# EAGLE design ESP_CAM_VVN (EAGLE 9.6.2)
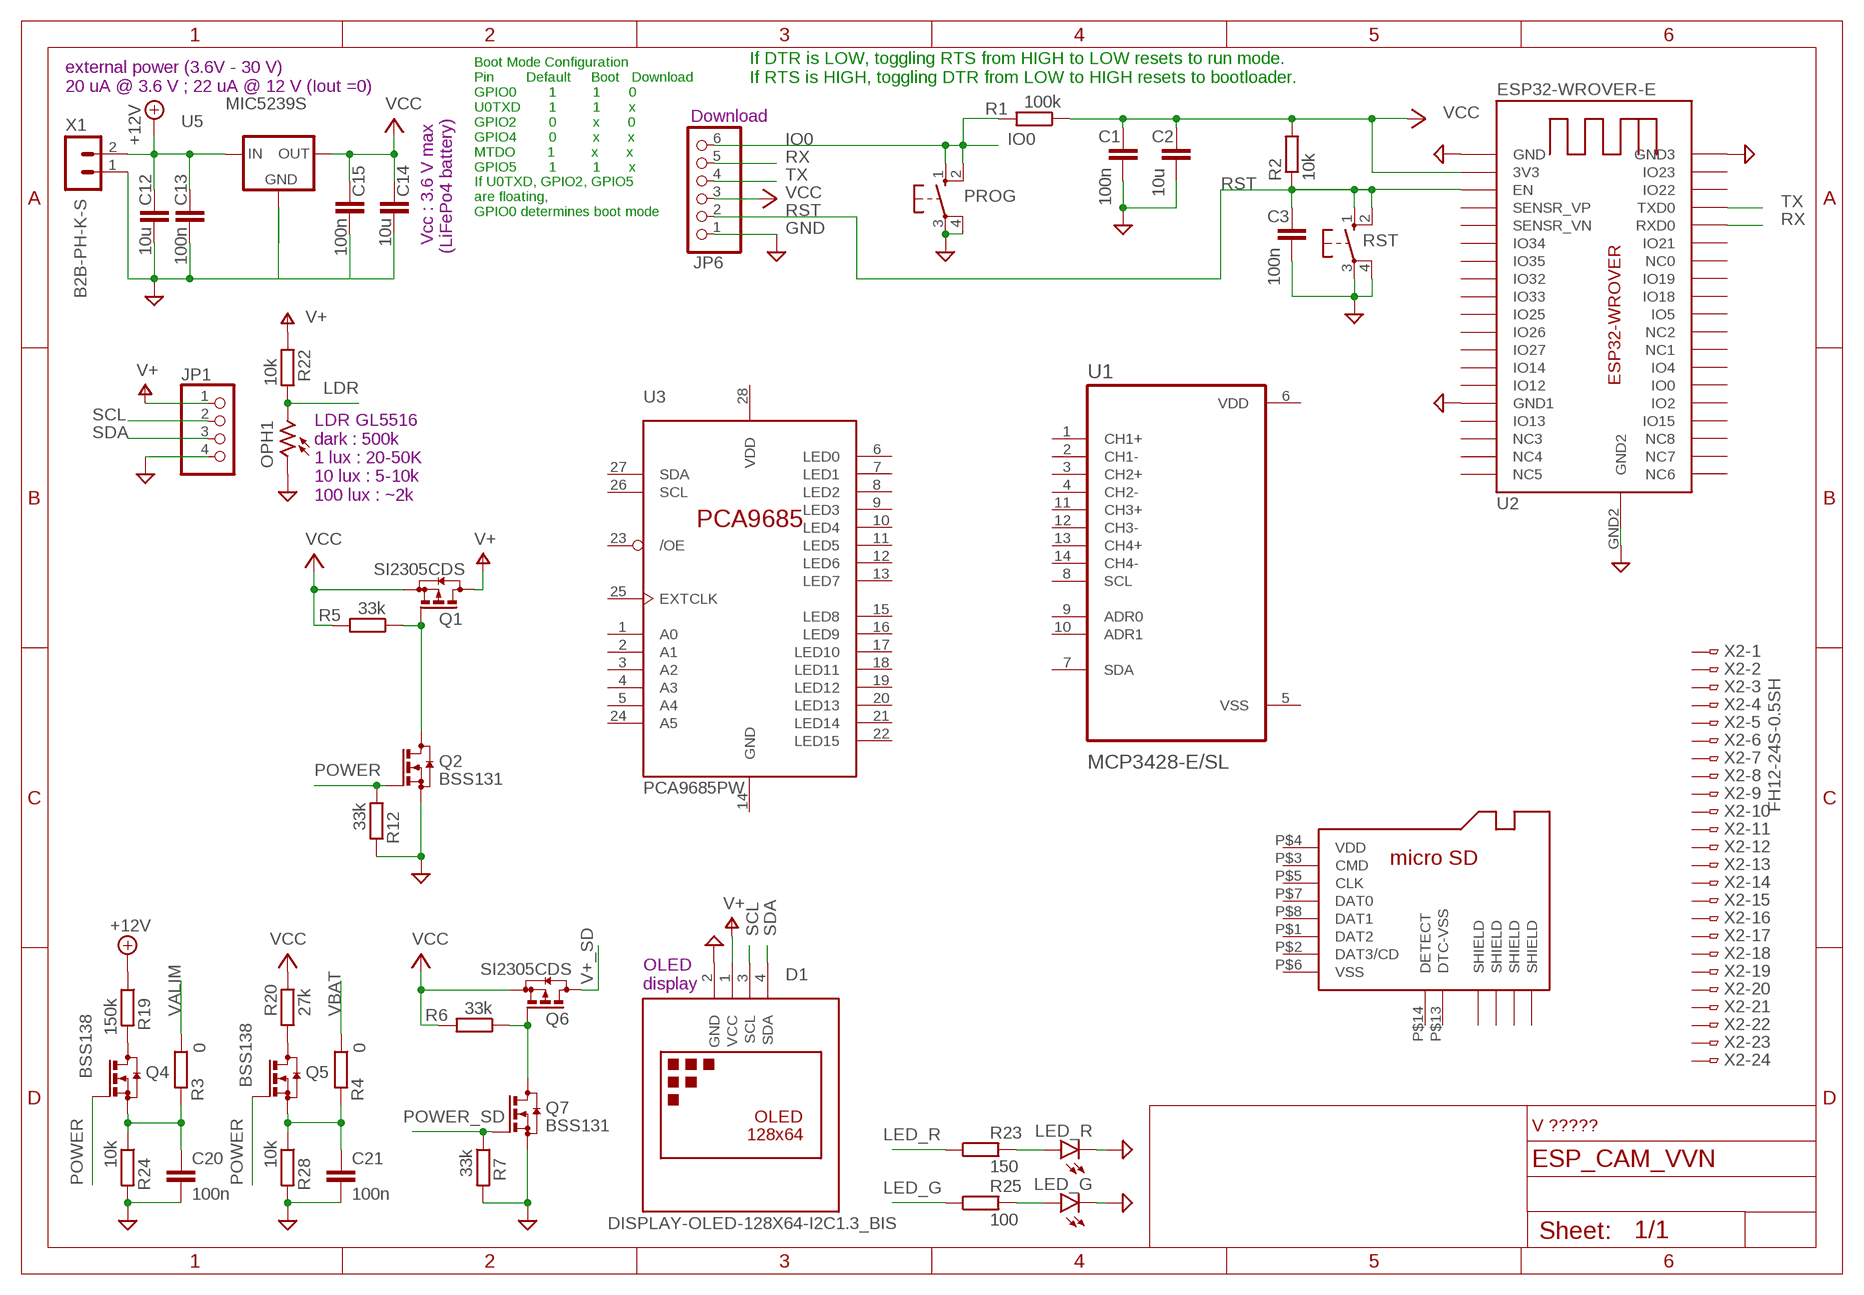
[diagram p0: schematic, sheet 1]

## Parts
C1  100n  CC1206  [C1206]
C2  10u  CC1210  [C1210]
C3  100n  CC1206  [C1206]
C12  10u  CC1210  [C1210]
C13  100n  CC1206  [C1206]
C14  10u  CC1210  [C1210]
C15  100n  CC1206  [C1206]
C20  100n  CC1206  [C1206]
C21  100n  CC1206  [C1206]
D1  DISPLAY-OLED-128X64-I2C1.3_BIS  [DISPLAY-OLED-128X64-1.3-I2C_BIS]
JP1  PINHD-1X4  [1X04]
JP6  PINHD-1X6  [1X06]
LED_G  LEDSMT1206  [1206]
LED_R  LEDSMT1206  [1206]
OPH1  VT93N2  [VT900]
PROG  10-XX  [B3F-10XX]
Q1  SI2305CDS  [SOT23]
Q2  BSS131  [SOT23]
Q4  BSS138  [SOT23]
Q5  BSS138  [SOT23]
Q6  SI2305CDS  [SOT23]
Q7  BSS131  [SOT23]
R1  100k  RR1206  [R1206]
R2  10k  RR1206  [R1206]
R3  0  RR1206  [R1206]
R4  0  RR1206  [R1206]
R5  33k  RR1206  [R1206]
R6  33k  RR1206  [R1206]
R7  33k  RR1206  [R1206]
R12  33k  RR1206  [R1206]
R19  150k  RR1206  [R1206]
R20  27k  RR1206  [R1206]
R22  10k  RR1206  [R1206]
R23  150  RR1206  [R1206]
R24  10k  RR1206  [R1206]
R25  100  RR1206  [R1206]
R28  10k  RR1206  [R1206]
RST  10-XX  [B3F-10XX]
SD1  MICRO-SD-8  [MICROSDMOLEX]
U1  MCP3428-E/SL  [SOIC127P600X175-14N]
U2  ESP32-WROVER-E  [ESP32-WROVER]
U3  PCA9685PW  [TSSOP28]
U5  MIC5239S  [SOT223]
X1  B2B-PH-K-S  [B2B-PH-K-S]
X2  FH12-24S-0.5SH  [FH12-24S-0.5SH]

## Nets
+12V: C12.1 C13.1 R19.1 U5.1(IN) X1.2
GND: C1.2 C2.2 C3.2 C12.2 C13.2 C14.2 C15.2 C20.2 C21.2 D1.2(GND) JP1.4 JP6.1 LED_G.C LED_R.C OPH1.1 PROG.3(P) PROG.4(P1) Q2.2(S) Q7.2(S) R7.2 R12.2 R24.2 R28.2 RST.3(P) RST.4(P1) U2.GND U2.GND1 U2.GND2 U2.GND3 U5.2(GND) U5.4(GND) X1.1
IO0: JP6.6 PROG.1(S) PROG.2(S1) R1.2
LDR: OPH1.2 R22.2
LED_G: R25.1
LED_R: R23.1
N$1: Q1.1(G) Q2.3(D) R5.1
N$2: Q4.3(D) R19.2
N$3: C20.1 Q4.2(S) R3.2 R24.1
N$4: C21.1 Q5.2(S) R4.2 R28.1
N$5: Q5.3(D) R20.1
N$6: Q6.1(G) Q7.3(D) R6.1
N$7: LED_R.A R23.2
N$8: LED_G.A R25.2
POWER: Q2.1(G) Q4.1(G) Q5.1(G) R12.1
POWER_SD: Q7.1(G) R7.1
RST: C3.1 JP6.2 R2.1 RST.1(S) RST.2(S1) U2.EN
RX: JP6.5 U2.RXD0
SCL: D1.3(SCL) JP1.2
SDA: D1.4(SDA) JP1.3
TX: JP6.4 U2.TXD0
V+: D1.1(VCC) JP1.1 Q1.3(D) R22.1
V+_SD: Q6.3(D)
VALIM: R3.1
VBAT: R4.1
VCC: C1.1 C2.1 C14.1 C15.1 JP6.3 Q1.2(S) Q6.2(S) R1.1 R2.2 R5.2 R6.2 R20.2 U2.VDD33(3V3) U5.3(OUT)
Unconnected: SD1.P$1(DAT2) SD1.P$2(DAT3/CD) SD1.P$3(CMD) SD1.P$5(CLK) SD1.P$7(DAT0) SD1.P$8(DAT1) U1.1(CH1+) U1.2(CH1-) U1.3(CH2+) U1.4(CH2-) U1.7(SDA) U1.8(SCL) U1.9(ADR0) U1.10(ADR1) U1.11(CH3+) U1.12(CH3-) U1.13(CH4+) U1.14(CH4-) U2.CLK(NC3) U2.CMD(NC4) U2.IO0 U2.IO2 U2.IO4 U2.IO5 U2.IO12 U2.IO13 U2.IO14 U2.IO15 U2.IO18 U2.IO19 U2.IO21 U2.IO22 U2.IO23 U2.IO25 U2.IO26 U2.IO27 U2.IO32 U2.IO33 U2.IO34 U2.IO35 U2.NC0 U2.NC1 U2.NC2 U2.SD0(NC5) U2.SD1(NC6) U2.SD2(NC7) U2.SD3(NC8) U2.SENSOR_VN(SENSR_VN) U2.SENSOR_VP(SENSR_VP) U3.1(A0) U3.2(A1) U3.3(A2) U3.4(A3) U3.5(A4) U3.6(LED0) U3.7(LED1) U3.8(LED2) U3.9(LED3) U3.10(LED4) U3.11(LED5) U3.12(LED6) U3.13(LED7) U3.15(LED8) U3.16(LED9) U3.17(LED10) U3.18(LED11) U3.19(LED12) U3.20(LED13) U3.21(LED14) U3.22(LED15) U3.23(/OE) U3.24(A5) U3.25(EXTCLK) U3.26(SCL) U3.27(SDA) X2.1 X2.2 X2.3 X2.4 X2.5 X2.6 X2.7 X2.8 X2.9 X2.10 X2.11 X2.12 X2.13 X2.14 X2.15 X2.16 X2.17 X2.18 X2.19 X2.20 X2.21 X2.22 X2.23 X2.24

## Notes on the sheet
- If DTR is LOW, toggling RTS from HIGH to LOW resets to run mode.
  If RTS is HIGH, toggling DTR from LOW to HIGH resets to bootloader.
- external power (3.6V - 30 V)
  20 uA @ 3.6 V ; 22 uA @ 12 V (Iout =0)
- Download
- Vcc : 3.6 V max 
  (LiFePo4 battery)
- Boot Mode Configuration
  Pin        Default     Boot   Download
  GPIO0        1         1       0
  U0TXD       1         1       x
  GPIO2        0         x       0
  GPIO4        0         x       x
  MTDO        1         x       x
  GPIO5        1         1       x
  If U0TXD, GPIO2, GPIO5 
  are floating, 
  GPIO0 determines boot mode
- LDR GL5516
  dark : 500k
  1 lux : 20-50K
  10 lux : 5-10k
  100 lux : ~2k
- OLED 
  display
- V ?????

## Power pins joined to a net without a drawn wire
DETECT: SD1.P$14(DETECT)
DTC-VSS: SD1.P$13(DTC-VSS)
GND: U3.14(GND)
SHIELD: SD1.P$9(SHIELD) SD1.P$10(SHIELD) SD1.P$11(SHIELD) SD1.P$12(SHIELD)
VDD: SD1.P$4(VDD) U1.6(VDD) U3.28(VDD)
VSS: SD1.P$6(VSS) U1.5(VSS)

## Library data of the parts
C1-C3 C12-C15 C20 C21 = eagle-ltspice:C: CAPACITOR, European symbol; SPICEMODEL: NONE; SPICEPREFIX: C
D1 = diy-modules1.8-perso:DISPLAY-OLED-128X64-I2C: 128x64 Dot Matrix OLED Module based on SSD1306 chip Variant with I2C interface More details available here: http://www.instructables.com/id/Monochrome-096-i2c-OLED-display-with-arduino-SSD13/ SSD1306 datasheet: https://cdn-shop.adafruit.com/datasheets/SSD1306.pdf Click here to find device on ebay.com <http://www.ebay.com/sch/oled+display+128x64+iic> Note: There are two variants: I2C and SPI. Search for the proper version.
JP1 = pinhead:PINHD-1X4: PIN HEADER
JP6 = pinhead:PINHD-1X6: PIN HEADER
LED_G LED_R = led:LED: LED OSRAM: - CHIPLED LG R971, LG N971, LY N971, LG Q971, LY Q971, LO R971, LY R971 LH N974, LH R974 LS Q976, LO Q976, LY Q976 LO Q996 - Hyper CHIPLED LW Q18S LB Q993, LB Q99A, LB R99A - SideLED LS A670, LO A670, LY A670, LG A670, LP A670 LB A673, LV A673, LT A673, LW A673 LH A674 LY A675 LS A676, LA A676, LO A676, LY A676, LW A676 LS A679, LY A679, LG A679 - Hyper Micro SIDELED® LS Y876, LA Y876, LO Y876, LY Y876 LT Y87S - SmartLED LW L88C, LW L88S LB L89C, LB L89S, LG L890 LS L89K, LO L89K, LY L89K LS L896, LA L896, LO L896, LY L896 - TOPLED LS T670, LO T670, LY T670, LG T670, LP T670 LSG T670, LSP T670, LSY T670, LOP T670, LYG T670 LG T671, LOG T671, LSG T671 LB T673, LV T673, LT T673, LW T673 LH T674 LS T676, LA T676, LO T676, LY T676, LB T676, LH T676, LSB T676, LW T676 LB T67C, LV T67C, LT T67C, LS T67K, LO T67K, LY T67K, LW E67C LS E67B, LA E67B, LO E67B, LY E67B, LB E67C, LV E67C, LT E67C LW T67C LS T679, LY T679, LG T679 LS T770, LO T770, LY T770, LG T770, LP T770 LB T773, LV T773, LT T773, LW T773 LH T774 LS E675, LA E675, LY E675, LS T675 LS T776, LA T776, LO T776, LY T776, LB T776 LHGB T686 LT T68C, LB T68C - Hyper Mini TOPLED® LB M676 - Mini TOPLED Santana® LG M470 LS M47K, LO M47K, LY M47K Source: http://www.osram.convergy.de LUXEON: - LUMILED® LXK2-PW12-R00, LXK2-PW12-S00, LXK2-PW14-U00, LXK2-PW14-V00 LXK2-PM12-R00, LXK2-PM12-S00, LXK2-PM14-U00 LXK2-PE12-Q00, LXK2-PE12-R00, LXK2-PE12-S00, LXK2-PE14-T00, LXK2-PE14-U00 LXK2-PB12-K00, LXK2-PB12-L00, LXK2-PB12-M00, LXK2-PB14-N00, LXK2-PB14-P00, LXK2-PB14-Q00 LXK2-PR12-L00, LXK2-PR12-M00, LXK2-PR14-Q00, LXK2-PR14-R00 LXK2-PD12-Q00, LXK2-PD12-R00, LXK2-PD12-S00 LXK2-PH12-R00, LXK2-PH12-S00 LXK2-PL12-P00, LXK2-PL12-Q00, LXK2-PL12-R00 Source: www.luxeon.com KINGBRIGHT: KA-3528ASYC Source: www.kingbright.com
OPH1 = photo-elements:VT9: Photoconductive Cell VT900 Series Source: http://optoelectronics.perkinelmer.com/content/Datasheets/DTS_vt900seriesdatasheet.pdf
PROG RST = switch-omron:10-XX: OMRON SWITCH; MPN: B3F-1000; OC_FARNELL: 176432; OC_NEWARK: 36M3542
Q1 Q6 = transistor-small-signal-perso:SI2305CDS: P-CHANNEL MOS FET
Q2 Q7 = transistor-small-signal-perso:BSS131: N-CHANNEL MOS FET
Q4 Q5 = detect:BSS138: N-CHANNEL MOS FET
R1-R7 R12 R19 R20 R22-R25 R28 = eagle-ltspice:R: RESISTOR, European symbol; SPICEMODEL: NONE; SPICEPREFIX: R
SD1 = micro-sd_cp:MICRO-SD-8: Connecteur de carte mémoire microSD de Molex - Séries 503398 et 504077
U1 = MCP3428-E_SL:MCP3428-E/SL: Check prices <https://pricing.snapeda.com/parts/MCP3428-E/SL/Microchip/view-part?ref=eda>; AVAILABILITY: In Stock; DESCRIPTION: 16 Bit Analog to Digital Converter 4 Input 1 Sigma-Delta 14-SOIC; MF: Microchip; MP: MCP3428-E/SL; PACKAGE: SOIC-14 Microchip; PRICE: None; PURCHASE-URL: https://pricing.snapeda.com/search/part/MCP3428-E/SL/?ref=eda
U2 = 32teeth - ESP32-WROVER:ESP32-WROVER-E: ESP32-WROVER-E
U3 = i2c-led-controller:PCA9685
U5 = micrel:MIC5239S: LDO REGULATOR
X1 = con-JST PH:B2B-PH: JST PH series header 2.00mm pitch disconnectable crimp style connectors, vertical (side entry type), 2 pins
X2 = con-hirose:FH12-24S-0.5S: 0.5mm Pitch Connectors For FPC/FFC Source: Data sheet <http://www.hirose.co.jp/cataloge_hp/e58605370.pdf>; MPN: FH12-24S-0.5SH(55); OC_FARNELL: 1324552; OC_NEWARK: 34M6170

## Board
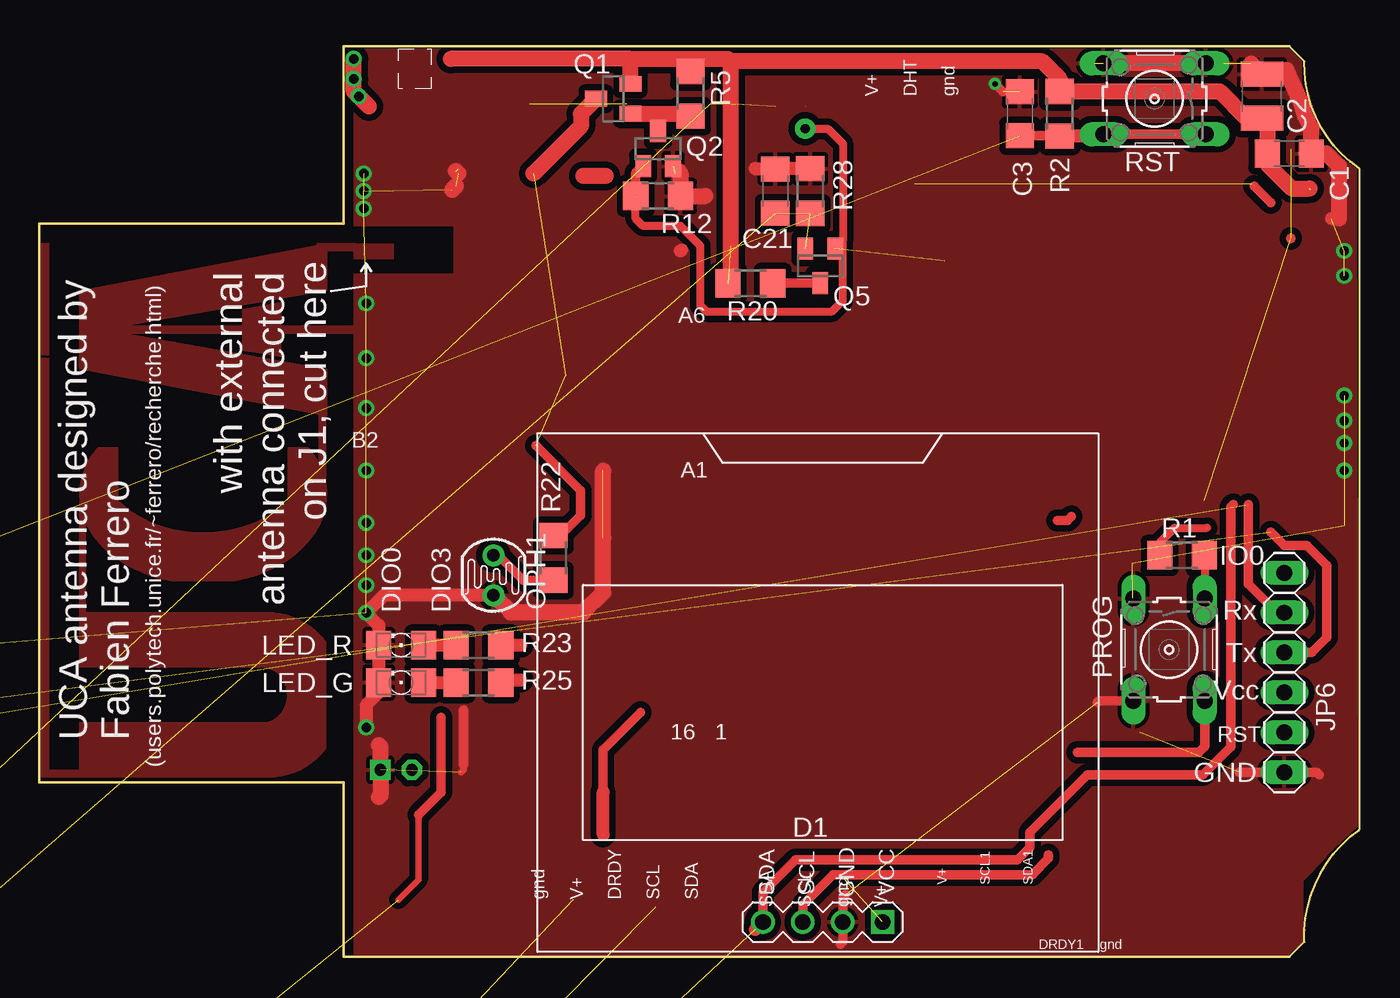
[diagram p1: board, top side]
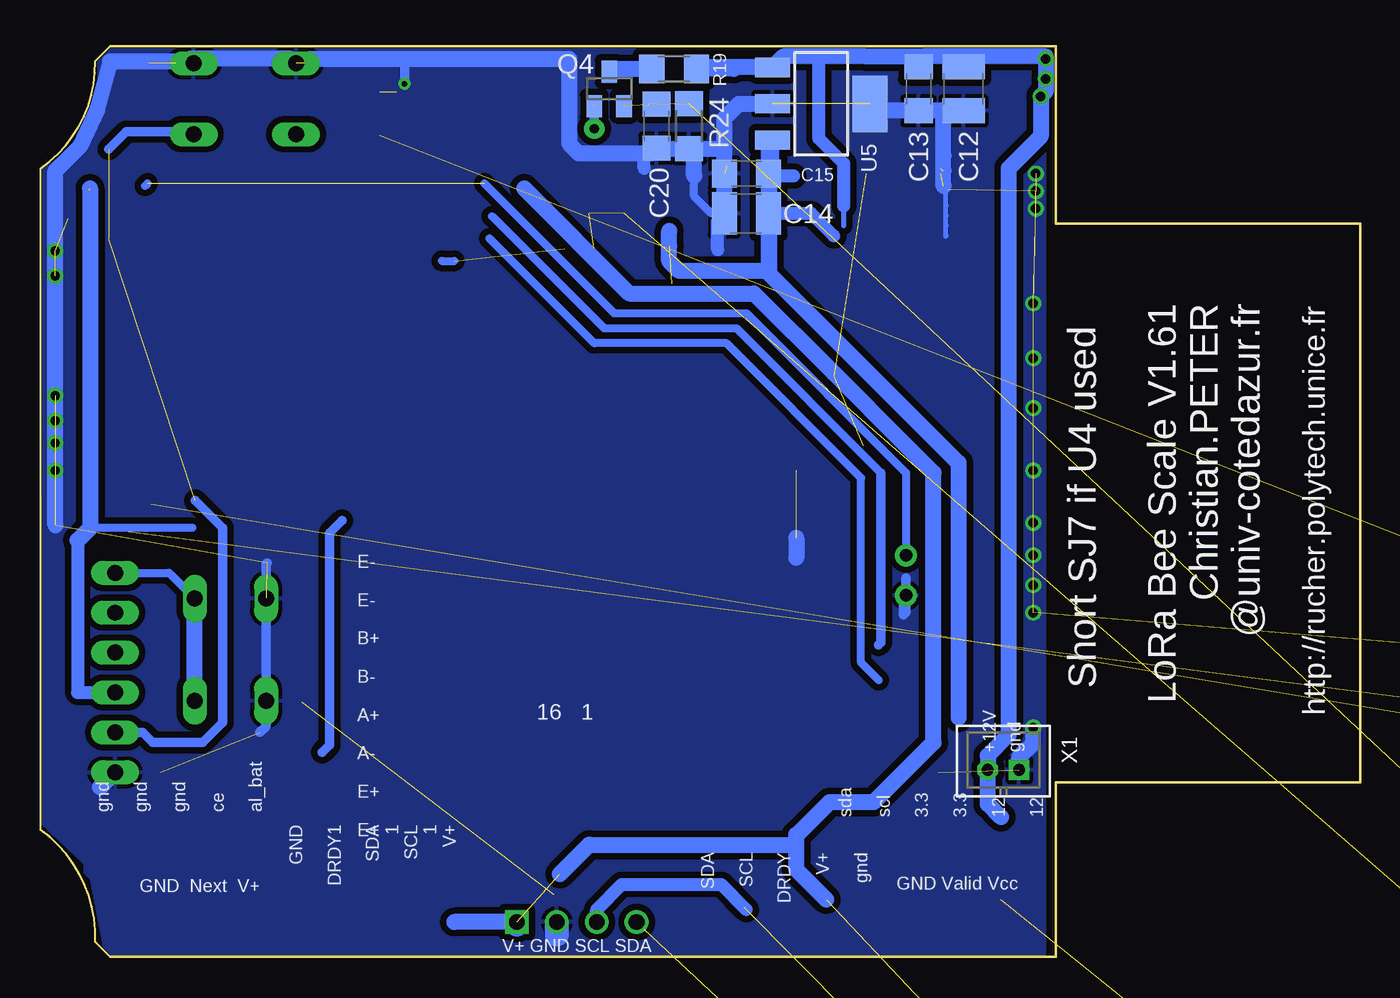
[diagram p2: board, bottom side, seen from below]

Size 83.98 x 57.94 mm. Coordinates in mm from the lower left corner, seen from the top.
Outline: 19.37,0 19.37,11.11 0,11.11 0,46.67 19.37,46.67 19.37,57.94 79.53,57.94 80.49,56.99 arc56 83.98,50.16 83.98,8.1 arc56 80.49,0.95 79.53,0 19.37,0
Copper layers (1*16): Top 0.035mm / dielectric 1.5mm / Bottom 0.035mm
Design rules "default *": minimum track width 6mil, minimum drill 0.35mm, track to track 6mil, track to pad 6mil, pad to pad 6mil, via to via 6mil, smd to smd 6mil, copper to edge 0mil, drill to drill 6mil, minimum pad ring 10mil, minimum via ring 8mil, stop-mask expansion 4mil, vias tented up to drill 0mil, thermal gap 10mil

### Footprints (pad centres in the part's own frame; a part is rotated, then mirrored left to right if it is on the bottom)
C1206 = smd 1.6 x 1.8: 1 -1.4,0; 2 1.4,0
C1210 = smd 1.6 x 2.7: 1 -1.4,0; 2 1.4,0
DISPLAY-OLED-128X64-1.3-I2C_BIS = drill 1 square: 1 -3.81,14.605 | drill 1: 2 -1.27,14.605; 3 1.27,14.605; 4 3.81,14.605
1X04 = drill 1.016 long: 1 -3.81,0; 2 -1.27,0; 3 1.27,0; 4 3.81,0
1X06 = drill 1.016 long: 1 -6.35,0; 2 -3.81,0; 3 -1.27,0; 4 1.27,0; 5 3.81,0; 6 6.35,0
1206 = smd 1.6 x 1.803: A -1.422,0; C 1.422,0
VT900 = drill 0.8 pad 1.4: 1 -1.27,0; 2 1.27,0
B3F-10XX = drill 1.016 long: 1 -3.251,2.261; 2 3.251,2.261; 3 -3.251,-2.261; 4 3.251,-2.261
SOT23 = smd 1 x 1.4: 1 -0.95,-1.1; 2 0.95,-1.1; 3 0,1.1
R1206 = smd 1.6 x 1.803: 1 -1.422,0; 2 1.422,0
MICROSDMOLEX = smd 0.7 x 1.1: P$1 12.15,-0.9; P$2 11.05,-0.9; P$3 9.95,-0.9; P$4 8.85,-0.9; P$5 7.75,-0.9; P$6 6.65,-0.9; P$7 5.55,-0.9; P$8 4.45,-0.9 | smd 1.14 x 1.83: P$9 0.57,-0.915 | smd 0.7 x 3.33: P$10 0.35,-12.165; P$11 13.31,-12.165 | smd 0.86 x 2.8: P$12 13.23,-1.4 | smd 0.9 x 0.93: P$13 2.66,-13.365 | smd 1.05 x 0.78: P$14 6.925,-13.44
SOIC127P600X175-14N = smd 1.9 x 0.6: 1 -2.455,3.81; 2 -2.455,2.54; 3 -2.455,1.27; 4 -2.455,0; 5 -2.455,-1.27; 6 -2.455,-2.54; 7 -2.455,-3.81; 8 2.455,-3.81; 9 2.455,-2.54; 10 2.455,-1.27; 11 2.455,0; 12 2.455,1.27; 13 2.455,2.54; 14 2.455,3.81
ESP32-WROVER = smd 1.7 x 0.9: CLK 18,1.27; CMD 0,1.27; EN 0,21.59; GND 0,24.13; GND1 0,6.35; GND3 18,24.13; IO0 18,7.62; IO2 18,6.35; IO4 18,8.89; IO5 18,12.7; IO12 0,7.62; IO13 0,5.08; IO14 0,8.89; IO15 18,5.08; IO18 18,13.97; IO19 18,15.24; IO21 18,17.78; IO22 18,21.59; IO23 18,22.86; IO25 0,12.7; IO26 0,11.43; IO27 0,10.16; IO32 0,15.24; IO33 0,13.97; IO34 0,17.78; IO35 0,16.51; NC0 18,16.51; NC1 18,10.16; NC2 18,11.43; RXD0 18,19.05; SD0 18,2.54; SD1 18,3.81; SD2 0,3.81; SD3 0,2.54; SENSOR_VN 0,19.05; SENSOR_VP 0,20.32; TXD0 18,20.32; VDD33 0,22.86 | smd 4.5 x 4.5: GND2 7.62,16.34
TSSOP28 = smd 0.305 x 0.991: 1 -4.225,-2.918; 2 -3.575,-2.918; 3 -2.925,-2.918; 4 -2.275,-2.918; 5 -1.625,-2.918; 6 -0.975,-2.918; 7 -0.325,-2.918; 8 0.325,-2.918; 9 0.975,-2.918; 10 1.625,-2.918; 11 2.275,-2.918; 12 2.925,-2.918; 13 3.575,-2.918; 14 4.225,-2.918; 15 4.225,2.918; 16 3.575,2.918; 17 2.925,2.918; 18 2.275,2.918; 19 1.625,2.918; 20 0.975,2.918; 21 0.325,2.918; 22 -0.325,2.918; 23 -0.975,2.918; 24 -1.625,2.918; 25 -2.275,2.918; 26 -2.925,2.918; 27 -3.575,2.918; 28 -4.225,2.918
SOT223 = smd 1.219 x 2.235: 1 -2.311,-3.099; 2 0,-3.099; 3 2.311,-3.099 | smd 3.6 x 2.2: 4 0,3.099
B2B-PH-K-S = drill 0.75 pad 1.3 square: 1 1,0 | drill 0.75 pad 1.3 octagon: 2 -1,0
FH12-24S-0.5SH = smd 0.3 x 1.3: 1 -5.75,3.25; 2 -5.25,3.25; 3 -4.75,3.25; 4 -4.25,3.25; 5 -3.75,3.25; 6 -3.25,3.25; 7 -2.75,3.25; 8 -2.25,3.25; 9 -1.75,3.25; 10 -1.25,3.25; 11 -0.75,3.25; 12 -0.25,3.25; 13 0.25,3.25; 14 0.75,3.25; 15 1.25,3.25; 16 1.75,3.25; 17 2.25,3.25; 18 2.75,3.25; 19 3.25,3.25; 20 3.75,3.25; 21 4.25,3.25; 22 4.75,3.25; 23 5.25,3.25; 24 5.75,3.25

### Placement (x,y rotation side)
C1  79.53,51.12 0 top
C2  77.79,54.77 90 top
C3  62.39,53.66 90 top
C12  25.24,55.24 270 bottom
C13  28.1,55.24 270 bottom
C14  39.05,47.31 180 bottom
C15  39.05,49.85 180 bottom
C20  44.77,52.86 270 bottom
C21  46.83,48.74 90 top
D1  49.85,16.83 180 top
JP1  -23.18,-61.12 0 top  (outside the outline)
JP6  79.22,18.1 90 top
LED_G  23.02,17.46 180 top
LED_R  23.02,19.84 180 top
OPH1  28.89,24.29 90 top
PROG  71.88,19.56 270 top
Q1  36.51,54.61 90 top
Q2  39.37,51.44 0 top
Q4  47.78,55.24 0 bottom
Q5  49.69,43.97 180 top
Q6  -26.51,-21.91 0 top  (outside the outline)
Q7  -26.51,-29.37 0 top  (outside the outline)
R1  72.71,25.56 0 top
R2  64.93,53.66 90 top
R3  -26.35,-8.89 0 top  (outside the outline)
R4  -26.35,-15.08 0 top  (outside the outline)
R5  41.43,54.93 90 top
R6  -18.73,-28.73 0 top  (outside the outline)
R7  -26.35,-36.2 0 top  (outside the outline)
R12  39.37,48.42 0 top
R19  43.66,56.52 180 bottom
R20  45.24,42.86 180 top
R22  32.7,25.4 270 top
R23  27.94,19.84 180 top
R24  42.7,52.86 270 bottom
R25  27.94,17.46 180 top
R28  49.05,48.74 90 top
RST  70.96,54.61 180 top
SD1  3.33,-9.84 0 top  (outside the outline)
U1  -32.7,-65.56 0 top  (outside the outline)
U2  -27.94,-4.76 0 top  (outside the outline)
U3  -30.48,-75.72 0 top  (outside the outline)
U5  34.29,54.29 270 bottom
X1  22.7,11.91 0 bottom
X2  -20.32,-68.9 0 top  (outside the outline)

### Tracks (layer width: path | path; a pad name or v marks a point on that pad's centre or on a via)
+12V  (via drill 0.6)
  Top 1.016: 20.96,54.13 v20.32,54.77 20,55.09 v20,55.88 v20,57.15
  Bottom 0.305: 27.79,57.3 27.78,57.31 | 31.43,57.31 31.44,57.3 | 30.14,57.29 30.16,57.31 | 32.85,46.51 32.86,46.51 32.86,47.78 32.84,47.81
  Bottom 0.813: 32.86,47.78 32.86,50.48 34.45,52.07 34.45,57.3
  Bottom 1.016: 25.24,57.31 20,57.31 20,55.09 v20.32,54.77 20.32,52.23 22.38,50.16 22.38,14.13 23.7,12.81 X1.2 23.7,9.73 22.86,8.89 | 25.24,57.31 27.78,57.31 30.16,57.31 31.43,57.31 | C12.1 25.24,57.31 | C13.1 28.1,56.99 27.79,57.3 | 39.85,56.52 R19.1 42.15,56.6 U5.1 36.69,57.3 34.45,57.3 31.44,57.3
ANT
  pour Top: 14.99,11.42 0.14,11.42 0.14,38.12 0.64,38.12 0.64,11.92 2.54,11.92 2.54,14.92 14.19,14.92 14.32,14.92 14.46,14.94 14.59,14.97 14.73,15.02 14.85,15.08 14.97,15.15 15.09,15.23 15.2,15.33 15.3,15.43 15.39,15.54 15.48,15.66 15.55,15.79 15.61,15.93 15.67,16.07 15.71,16.21 15.74,16.36 15.76,16.51 15.76,16.67 15.76,16.82 15.74,16.97 15.71,17.12 15.67,17.26 15.61,17.41 15.55,17.54 15.48,17.67 15.39,17.79 15.3,17.9 15.2,18 15.09,18.1 14.97,18.18 14.85,18.25 14.73,18.31 14.59,18.36 14.46,18.39 14.32,18.41 14.19,18.42 2.54,18.42 2.54,28.92 2.57,28.92 2.55,29.53 2.61,30.14 2.75,30.73 2.99,31.34 3.31,31.9 3.72,32.41 5.03,32.41 5.03,28.92 5.17,28.92 5.5,28.62 5.85,28.36 6.22,28.12 6.63,27.89 7.06,27.69 7.5,27.51 7.96,27.36 8.44,27.24 8.92,27.14 9.42,27.07 9.92,27.02 10.42,27.01 10.92,27.02 11.42,27.07 11.92,27.14 12.41,27.24 12.88,27.36 13.35,27.51 13.78,27.69 14.21,27.89 14.62,28.12 14.99,28.36 15.34,28.62 15.67,28.92 15.82,28.92 15.82,32.41 17.13,32.41 17.25,32.26 17.37,32.11 17.49,31.94 17.59,31.78 17.69,31.62 17.79,31.45 17.79,34.51 2.54,37.42 2.54,42.41 17.64,45.29 17.64,45.42 20.14,45.42 20.14,45.41 20.64,45.41 20.64,45.24 20.76,45.24 20.76,45.41 22.54,45.41 22.54,44.39 20.77,44.39 20.77,44.56 20.64,44.56 20.64,44.4 19.99,44.4 19.99,44.92 18.31,44.92 18.31,42.41 5.61,40.17 12.91,40.17 12.91,41.22 15.4,41.66 15.4,40.17 19.99,40.17 19.99,40.42 20.39,40.42 20.39,39.41 19.99,39.41 19.99,39.67 15.4,39.67 15.4,38.16 14.21,38.38 13.08,38.55 13.08,38.59 12.91,38.61 12.91,39.67 5.61,39.67 18.31,37.42 18.31,34.42 18.24,34.43 18.24,30.17 18.3,29.63 18.29,29.08 18.21,28.54 18.06,27.99 17.83,27.47 17.55,26.98 17.18,26.48 16.76,26.03 16.3,25.61 15.76,25.21 15.17,24.87 14.57,24.57 13.89,24.29 13.2,24.08 12.49,23.92 8.35,23.92 7.75,24.05 7.15,24.23 6.57,24.44 6.03,24.68 5.51,24.95 5.02,25.27 4.58,25.59 4.16,25.94 3.79,26.34 3.47,26.73 3.19,27.15 2.95,27.59 2.95,21.92 14.99,21.92 14.99,21.9 15.4,21.85 15.81,21.75 16.21,21.62 16.59,21.44 16.96,21.23 17.31,20.99 17.65,20.71 17.96,20.4 18.24,20.06 18.24,13.27 17.96,12.93 17.65,12.62 17.31,12.34 16.96,12.1 16.59,11.89 16.21,11.71 15.81,11.58 15.4,11.48 14.99,11.43
ANT1
  pour Top: 0.64,38.31 0.14,38.31 0.14,45.42 0.64,45.42
GND  (via drill 0.35, 0.6)  (40 unrouted)
  Top 0.406: 26.99,12.22 26.99,11.91 26.83,11.75
  Top 0.61: 26.99,15.72 26.99,12.23 26.99,12.22 | 21.6,16.83 LED_G.C | PROG.4 67.42,16.31 67.31,16.19 | 76.36,11.75 JP6.1 81.28,11.75 81.44,11.59 | 51.28,3.97 51.12,3.81 D1.2 51.12,0.95 50.96,0.79 | 61.31,55.06 v60.8,55.56 | RST.4 75.37,56.87
  Top 0.813: PROG.3 69.57,22.86 | OPH1.1 21.91,23.02 v20.8,21.91 21.6,21.11 LED_R.C LED_G.C 21.6,16.83 20.8,16.03 v20.8,14.61 | 82.2,46.99 82.71,46.99 | R28.2 46.85,50.16 C21.2 45.59,50.14 45.56,50.16 | 40.78,44.94 40.8,44.93 40.88,45.01
  Top 1.016: OPH1.1 30,21.91 34.61,21.91 35.88,23.18 35.88,26.67 35.88,30.94 | 26.51,49.05 26.28,48.82 | 26.67,49.85 26.51,50.01 | Q2.2 40.79,49.86 R12.2 42.39,48.42 | 21.59,13.49 21.7,13.38 X1.1 21.7,10.27 21.59,10.16 | 82.71,46.99 82.71,50.32 81.92,51.12 C1.2 80.93,52.74 80.83,52.95 | 80.83,52.95 | 80.83,52.95 80.54,53.51 80.23,54.49 79.34,56.43 C2.2 77.09,56.87 | RST.3 RST.4
  Bottom 0.305: 26.67,50.16 26.51,50.01 | 26.37,45.86 26.35,45.88 26.35,46.51 | 26.35,46.51 26.35,47.15 | 26.35,47.15 26.35,47.78 | 26.35,47.78 26.35,48.9 26.51,49.05 | 26.38,47.81 26.35,47.78 | 26.36,47.16 26.35,47.15 | 26.36,46.51 26.35,46.51
  Bottom 0.508: C14.2 41.27,47.31 42.39,48.42 42.39,49.69
  Bottom 0.61: 66.83,56.99 66.83,57.15 | OPH1.1 28.89,21.91 29.05,21.75 29.05,22.86 OPH1.1 | OPH1.1 28.89,24.13 | 70.01,14.29 69.62,14.68 PROG.4 69.62,24.99 69.53,25.08 | v60.8,55.56 60.8,57.15
  Bottom 0.813: 27.94,54 C13.2 | 45.56,50.16 45.56,50.99 45.72,51.15 | 40.88,45.01 40.88,46.88 C14.2 | RST.3 74.33,56.99 74.49,57.15
  Bottom 1.016: R24.2 42.67,51.41 | R24.2 44.74,51.44 C20.2 45.09,51.15 45.72,51.15 49.72,51.15 50.32,51.75 50.32,57.15 58.26,57.15 60.8,57.15 66.83,57.15 67.11,56.87 | 80.17,10.79 JP6.1 | 35.88,26.67 35.88,25.4 | C12.2 26.51,53.84 | 26.51,53.84 27.78,53.84 27.94,54 | 26.51,49.05 26.51,50.01 26.51,50.96 26.51,53.84 | 40.45,51.44 40.45,53.37 39.53,54.29 U5.2 | R24.2 40.46,51.44 40.45,51.44 | C13.2 30.74,53.84 U5.4 | 42.39,49.69 42.39,51.12 R24.2 | 40.45,51.44 C15.2 C14.2 | v20.8,14.61 20.8,13.61 21.7,12.7 X1.1 | 83.03,27.46 83.03,50.01 81.44,51.59 80.33,53.98 79.53,56.88 79.53,56.99 74.33,56.99 | RST.4 67.99,57.15 74.49,57.15
  Bottom 1.524: D1.2 51.12,1.43
  other vias: 20.8,41.59 83.03,43.34 83.03,35.72 83.03,30.96 83.03,44.93 20.8,38.1 83.03,34.13 83.03,32.7 20.8,34.92 20.8,30.96 20.8,27.62 20.8,25.56 20.8,23.65 20.64,47.62 20.64,49.85 20.64,48.74
  pour Top (isolate 0.406): 20,0 20,43.5 26.35,43.5 26.35,46.51 20,46.51 20,57.78 79.53,57.78 80.33,56.99 80.33,55.56 81.81,51.62 83.82,50.12 83.93,8.33 81.9,6.43 81.9,6.33 80.41,4.85 80.41,1.04 79.38,0
  pour Bottom (isolate 0.406): 20,0 20,57.78 79.53,57.78 80.33,56.99 80.33,52.72 83.82,50.13 83.93,8.45 81.21,5.89 81.21,5.32 80.79,4.91 79.98,0.61 79.38,0
IO0  (2 unrouted)
  Top 0.508: R1.2 74.14,25.55 PROG.1
  Top 0.61: 66.04,13.02 73.77,13.02 74.14,13.39 PROG.2 | 64.77,27.78 65.41,27.78 65.65,28.03
  Bottom 0.508: JP6.6 75.78,24.45 PROG.1
  Bottom 0.61: 66.04,13.02 65.56,13.49 65.56,26.99 64.77,27.78
  Bottom 0.813: PROG.1 74.14,22.87
  Bottom 1.016: PROG.2 PROG.1
LDR  (2 unrouted)
  Top 0.61: 77.31,49.05 78.35,48.01 | OPH1.2 29.21,25.56 30.8,23.97 R22.2
  Bottom 0.508: 55.72,49.21 47.47,40.96 39.05,40.96 28.89,30.8 OPH1.2 | 77.15,49.21 77.31,49.05
LED_G  (1 unrouted)
  Top 0.813: R25.1 29.52,17.62 30.64,17.62
  Bottom 0.508: 55.4,45.72 48.74,39.05 40.32,39.05 31.75,30.48 31.75,18.73 30.64,17.62
LED_R  (1 unrouted)
  Top 0.813: R23.1 30.64,19.84
  Bottom 0.508: 55.24,47.14 48.11,40.01 39.69,40.01 30.48,30.8
  Bottom 0.61: 30.48,30.8 30.48,20 30.64,19.84
N$1
  Top 0.508: Q2.3 39.2,52.7 39.2,53.51
  Top 0.61: R5.1 39.2,53.51
  Top 1.016: Q1.1 41.28,53.66 R5.1
N$2
  Bottom 1.016: Q4.3 47.61,56.52 R19.2
N$3  (3 unrouted)
N$4  (3 unrouted)
N$5
  Top 0.61: R20.1 46.68,42.87 Q5.3
N$6  (2 unrouted)
N$7
  Top 0.61: LED_R.A 24.68,19.61
  Top 0.813: LED_R.A R23.2
N$8
  Top 0.813: LED_G.A R25.2
POWER  (via drill 0.6 pad 1.3)  (3 unrouted)
  Top 0.508: R12.1 37.94,46.99 38.42,46.51 40.8,46.51 42.07,45.24 42.07,41.43 42.44,41.07 50.43,41.07 51.12,41.75 51.12,44.29 51.12,45.55 | v48.74,52.7 50.16,52.7 51.12,51.75 51.12,45.55 | 51.12,45.55 Q5.1
  Top 0.61: R12.1 37.95,49.86 Q2.1
  Bottom 0.508: 58.44,44.29 57.63,44.29
  Bottom 0.61: Q4.1 v48.74,52.7
POWER_SD  (1 unrouted)
RST  (3 unrouted)
  Top 0.61: 79.62,45.73 79.61,45.72 | C3.1 64.91,52.26 R2.1 | RST.2 RST.1
  Top 0.813: RST.2 67.6,52.24 R2.1
  Bottom 0.61: JP6.2 77.47,14.29 76.83,13.65 73.66,13.65 72.39,14.92 72.39,27.3 74.14,29.05 | 79.61,51.4 78.5,52.51 74.37,52.51 RST.1
  Bottom 0.813: RST.2 67.87,52.51
RX  (1 unrouted)
  Top 0.61: JP6.5 78.74,21.91 76.92,23.72 76.92,28.79
SCL  (1 unrouted)
  Top 0.61: D1.3 48.58,3.33 50.48,5.24 63.18,5.24 64.21,6.27 64.21,6.51
  Bottom 0.61: 39.05,3.02 39.21,3.17
  Bottom 0.813: D1.3 48.58,3.02 46.98,4.61 40.65,4.61 39.05,3.02
SDA  (1 unrouted)
  Top 0.61: D1.4 46.04,4.13 48.1,6.19 62.23,6.19 63.02,6.99 63.02,7.94 66.67,11.59 74.04,11.59 75.81,13.36 75.81,28.63 75.97,28.79
  Top 0.813: 45.56,1.75 D1.4
SHIELD  (3 unrouted)
TX  (1 unrouted)
  Top 0.61: 78.35,27.06 79.22,26.19 80.64,26.19 81.92,24.92 81.92,20.32 80.96,19.37 JP6.4
V+  (5 unrouted)
  Top 0.61: 35.88,10.48 35.88,13.18 38.26,15.56 | R22.1 33.17,26.82 34.45,28.1 34.45,29.69 31.59,32.54
  Top 0.813: 35.88,7.78 35.88,10.48
  Top 1.016: Q1.3 34.46,53.66 34.46,52.88 31.43,49.85
  Bottom 0.61: 33.5,36.98 33.5,37.15
  Bottom 1.016: 50.93,5.27 49.05,7.14 35.88,7.14 | 35.88,7.14 35.88,5.56 33.97,3.65 | 35.88,7.14 35.88,7.73 | 35.88,7.73 35.88,7.78 | D1.1 57.63,2.22 | 35.88,7.73 33.77,9.84 30.96,9.84 27.15,13.65 27.15,30.8 28.97,32.62 33.5,37.15 38.58,42.23 46.51,42.23 53.18,48.9
  Bottom 1.524: 53.66,2.06 D1.1
VCC  (8 unrouted)
  Top 0.406: 22.86,3.65 24.13,4.92 24.13,9.05
  Top 0.508: R1.1 71.28,26.36 72.23,27.3 74.3,27.3
  Top 0.61: 25.56,15.24 25.56,10.48 24.13,9.05
  Top 0.813: 80.89,48.8 80.8,48.9
  Top 1.016: 37.61,57.15 26.18,57.15 | Q1.2 37.61,57.15 | 37.61,57.15 41.43,57.15 | 41.43,57.15 43.81,57.15 43.81,56.99 43.97,56.99 | 43.97,56.99 63.82,56.99 64.93,55.88 R2.2 75.1,55.08 76.83,53.34 77.76,53.34 C2.1 78.13,53.02 C1.1 78.13,50.45 79.69,48.9 80.8,48.9 | R5.2 41.43,57.15 | 36.04,49.69 34.61,49.69 | R20.2 43.97,43.01 43.97,44.29 43.97,56.99
  Bottom 0.305: 33.47,45.86 33.5,45.88
  Bottom 0.508: 74.3,27.3 80.8,27.3
  Bottom 0.813: 81.6,26.51 81.6,16.83 JP6.3 | 36.04,49.69 37.49,49.69 C15.1 | 33.5,45.88 34.92,47.31 C14.1
  Bottom 1.016: 37.62,43.5 25.56,31.43 25.56,15.24 | U5.3 37.65,51.72 C15.1 C14.1 37.65,43.53 37.62,43.5 | 81.6,26.51 80.8,27.3 80.8,48.9 | 37.62,43.66 43.34,43.66 43.97,44.29 43.97,46.2 43.97,45.24 | U5.3 37.49,51.88 37.49,49.69 | U5.3 37.62,51.75 37.62,43.66 | 37.62,43.66 37.62,43.5
VDD  (2 unrouted)
VSS  (1 unrouted)

### Text on the board
tNames: V+ / / DHT / / gnd | with external / antenna connected / on J1, cut here | A6 | B2 | A1 | IO0 | Rx | DIO0 | DIO3 | Tx | Vcc | UCA antenna designed by / Fabien Ferrero | 16 1 | RST | (users.polytech.unice.fr/~ferrero/recherche.html) | GND | V+ / / / SCL1 / / / SDA1 | gnd / / V+ / / DRDY / / SCL / / SDA | SDA / / SCL / / gnd / / V+ | DRDY1 gnd
bNames: LoRa Bee Scale V1.61 / Christian.PETER / @univ-cotedazur.fr | http://rucher.polytech.unice.fr | Short SJ7 if U4 used | E- / / E- / / B+ / / B- / / A+ / / A- / / E+ / / E+ | 16 1 | gnd | +12V | sda / / scl / / 3.3 / / 3.3 / / 12 / / 12 | gnd / / gnd / / gnd / / ce / / al_bat | GND / / DRDY1 / / SDA / 1 / SCL / 1 / V+ | SDA / / SCL / / DRDY / / V+ / / gnd | GND Valid Vcc | GND Next V+ | V+ GND SCL SDA
tValues: 84 x 58 mm